# EAGLE design nav_module (EAGLE 7.4.0)
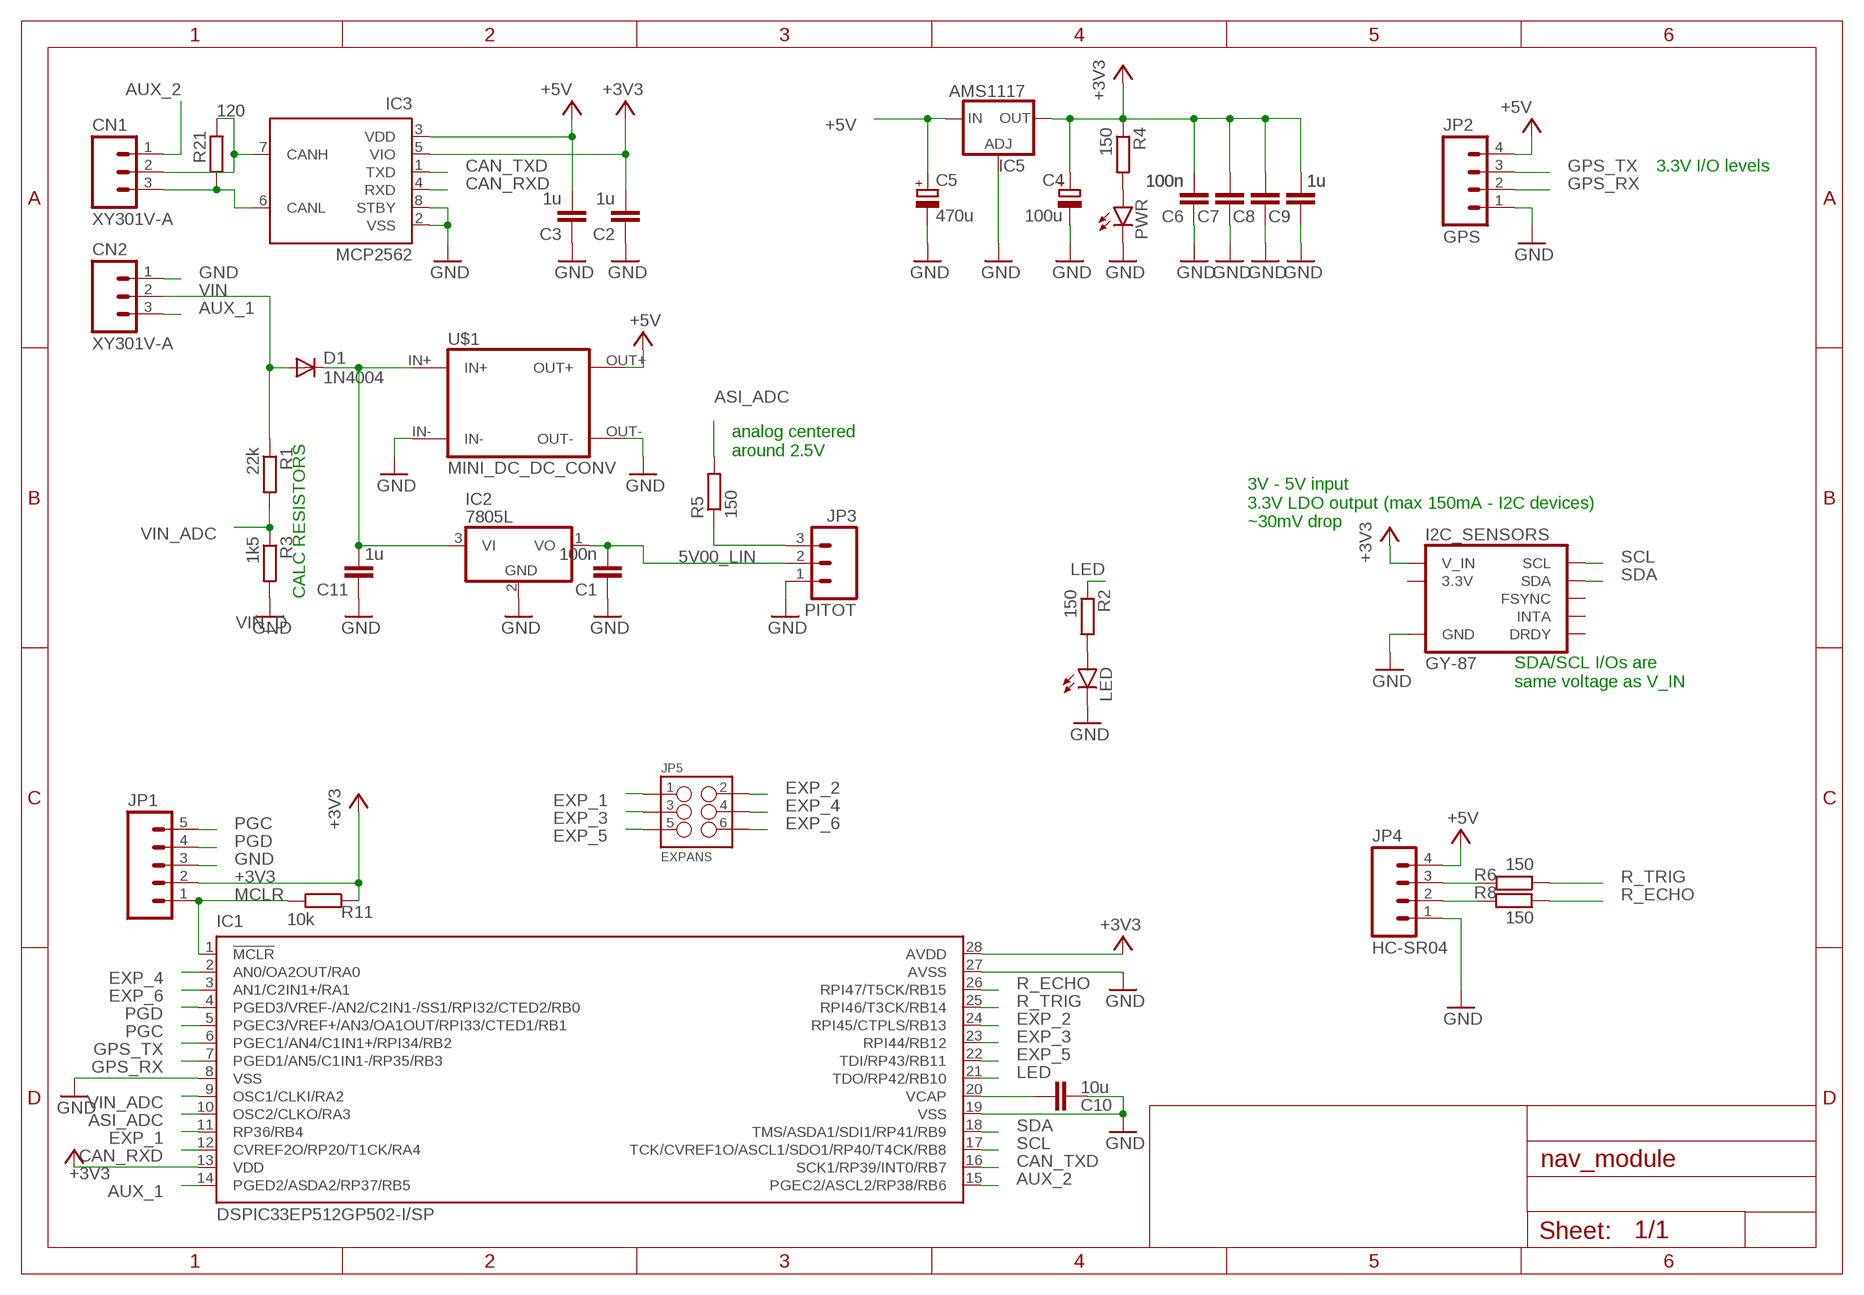
[diagram p0: schematic, sheet 1]

## Parts
C1  100n  C-EUC0603K  [C0603K]
C2  1u  C-EUC0603K  [C0603K]
C3  1u  C-EUC0603K  [C0603K]
C4  100u  CPOL-EUE2.5-7  [E2,5-7]
C5  470u  CPOL-EUE3.5-8  [E3,5-8]
C6  100n  C-EUC0603K  [C0603K]
C7  100n  C-EUC0603K  [C0603K]
C8  1u  C-EUC0603K  [C0603K]
C9  1u  C-EUC0603K  [C0603K]
C10  10u  C-EU025-030X050  [C025-030X050]
C11  1u  C-EUC0603K  [C0603K]
CN1  XY301V-A  [XY301V-A]
CN2  XY301V-A  [XY301V-A]
D1  1N4004  [DO41-10]
I2C_SENSORS  GY-87  [GY-87]
IC1  DSPIC33EP512GP502-I/SP  [DIL28-3]
IC2  7805L  [TO92]
IC3  MCP2562  MCP2562-E/P  [DIL8]
IC5  AMS1117  LD117AS33TR  [SOT223]
JP1  M05PTH  [1X05]
JP2  GPS  M04PTH  [1X04]
JP3  PITOT  M03PTH  [1X03]
JP4  HC-SR04  M04PTH  [1X04]
JP5  EXPANS  M03X2FEMALE  [2X3]
LED  LED-FKIT-1206  [FKIT-LED-1206]
PWR  LED-FKIT-1206  [FKIT-LED-1206]
R1  22k  R-EU_R0603  [R0603]
R2  150  R-EU_R0603  [R0603]
R3  1k5  R-EU_R0603  [R0603]
R4  150  R-EU_R0603  [R0603]
R5  150  R-EU_R0603  [R0603]
R6  150  R-EU_R0603  [R0603]
R8  150  R-EU_R0603  [R0603]
R11  10k  R-EU_R0603  [R0603]
R21  120  R-EU_R0603  [R0603]
U$1  MINI_DC_DC_CONV  [DSN-MINI-360]

## Nets
5V00_LIN: C1.2 IC2.1(VO) JP3.2
+3V3: C2.2 C4.+ C6.2 C7.2 C8.2 C9.2 I2C_SENSORS.VCC_IN(V_IN) IC1.13(VDD) IC1.28(AVDD) IC3.5(VIO) IC5.2(OUT) IC5.@2(OUT) JP1.2 R4.1 R11.1
+5V: C3.2 C5.+ IC3.3(VDD) IC5.3(IN) JP2.4 JP4.4 U$1.OUT+
ASI: JP3.3 R5.1
ASI_ADC: IC1.10(OSC2/CLKO/RA3) R5.2
AUX_1: CN2.3 IC1.14(PGED2/ASDA2/RP37/RB5)
AUX_2: CN1.1 IC1.15(PGEC2/ASCL2/RP38/RB6)
CAN_H: CN1.2 IC3.7(CANH) R21.2
CAN_L: CN1.3 IC3.6(CANL) R21.1
CAN_RXD: IC1.12(CVREF2O/RP20/T1CK/RA4) IC3.4(RXD)
CAN_TXD: IC1.16(SCK1/RP39/INT0/RB7) IC3.1(TXD)
EXP_1: IC1.11(RP36/RB4) JP5.1
EXP_2: IC1.24(RPI45/CTPLS/RB13) JP5.2
EXP_3: IC1.23(RPI44/RB12) JP5.3
EXP_4: IC1.2(AN0/OA2OUT/RA0) JP5.4
EXP_5: IC1.22(TDI/RP43/RB11) JP5.5
EXP_6: IC1.3(AN1/C2IN1+/RA1) JP5.6
GND: C1.1 C2.1 C3.1 C4.- C5.- C6.1 C7.1 C8.1 C9.1 C10.1 C11.1 CN2.1 I2C_SENSORS.GND IC1.8(VSS) IC1.19(VSS) IC1.27(AVSS) IC2.2(GND) IC3.2(VSS) IC3.8(STBY) IC5.1(ADJ) JP1.3 JP2.1 JP3.1 JP4.1 LED.C PWR.C R3.2 U$1.IN- U$1.OUT-
GPS_RX: IC1.7(PGED1/AN5/C1IN1-/RP35/RB3) JP2.2
GPS_TX: IC1.6(PGEC1/AN4/C1IN1+/RPI34/RB2) JP2.3
HS_ECHO: JP4.2 R8.1
HS_TRIG: JP4.3 R6.2
LED: IC1.21(TDO/RP42/RB10) R2.1
MCLR: IC1.1(!MCLR!) JP1.1 R11.2
N$3: PWR.A R4.2
N$4: LED.A R2.2
PGC: IC1.5(PGEC3/VREF+/AN3/OA1OUT/RPI33/CTED1/RB1) JP1.5
PGD: IC1.4(PGED3/VREF-/AN2/C2IN1-/SS1/RPI32/CTED2/RB0) JP1.4
R_ECHO: IC1.26(RPI47/T5CK/RB15) R8.2
R_TRIG: IC1.25(RPI46/T3CK/RB14) R6.1
SCL: I2C_SENSORS.SCL IC1.17(TCK/CVREF1O/ASCL1/SDO1/RP40/T4CK/RB8)
SDA: I2C_SENSORS.SDA IC1.18(TMS/ASDA1/SDI1/RP41/RB9)
VCAP: C10.2 IC1.20(VCAP)
VIN: CN2.2 D1.A R1.1
VIN_ADC: IC1.9(OSC1/CLKI/RA2) R1.2 R3.1
VIN_D: C11.2 D1.C IC2.3(VI) U$1.IN+
Unconnected: I2C_SENSORS.DRDY I2C_SENSORS.FSYNC I2C_SENSORS.INTA

## Notes on the sheet
- 3.3V I/O levels
- analog centered
  around 2.5V
- 3V - 5V input
  3.3V LDO output (max 150mA - I2C devices)
  ~30mV drop
- CALC RESISTORS
- SDA/SCL I/Os are
  same voltage as V_IN

## Power pins joined to a net without a drawn wire
3.3V: I2C_SENSORS.3.3V

## Library data of the parts
C1-C3 C6-C11 = rcl:C-EU: CAPACITOR, European symbol
C4 C5 = rcl:CPOL-EU: POLARIZED CAPACITOR, European symbol
CN1 CN2 = aliexpress_modules:XY301V-A: 3 Pin Screw Terminal Block Connector 5mm Pitch 5.08-301-3P 301-3P 3pin
D1 = diode:1N4004: DIODE general purpose rectifier, 1 A
I2C_SENSORS = aliexpress_modules:GY-87: GY-87 10DOF MPU6050 HMC5883L BMP180 module
IC1 = microchip:DSPIC33EP512*502: 16-Bit Microcontrollers and Digital Signal Controllers with High-Speed PWM, Op Amps and Advanced Analog Source: ww1.microchip.com/downloads/en/DeviceDoc/70000657H.pdf
IC2 = linear:78*: Positive VOLTAGE REGULATOR Source: http://cache.national.com/ds/LM/LM78L05.pdf http://www.fairchildsemi.com/ds/LM/LM7805.pdf
IC3 = microchip:MCP2562: High-Speed CAN Transceiver Source: http://ww1.microchip.com/downloads/en/DeviceDoc/20005167C.pdf
IC5 = v-reg:LD117A?*: Low drop fixed and adjustable positive voltage regulators 1 A Source: http://www.st.com/stonline/products/literature/ds/7194/ld1117axx.pdf
JP1 = SparkFun-Connectors:M05: Header 5 Standard 5-pin 0.1" header. Use with straight break away headers (SKU : PRT-00116), right angle break away headers (PRT-00553), swiss pins (PRT-00743), machine pins (PRT-00117), and female headers (PRT-00115). Molex polarized connector foot print use with SKU : PRT-08230 with associated crimp pins and housings.
JP2 JP4 = SparkFun-Connectors:M04: Header 4 Standard 4-pin 0.1" header. Use with straight break away headers (SKU : PRT-00116), right angle break away headers (PRT-00553), swiss pins (PRT-00743), machine pins (PRT-00117), and female headers (PRT-00115). Molex polarized connector foot print use with SKU : PRT-08231 with associated crimp pins and housings. 1MM SMD Version SKU: PRT-10208
JP3 = SparkFun-Connectors:M03: Header 3 Standard 3-pin 0.1" header. Use with straight break away headers (SKU : PRT-00116), right angle break away headers (PRT-00553), swiss pins (PRT-00743), machine pins (PRT-00117), and female headers (PRT-00115). Molex polarized connector foot print use with SKU : PRT-08232 with associated crimp pins and housings.
JP5 = SparkFun-Connectors:M03X2: 2x3 .1" header. Shrouded, with keying- CONN-10681 SMT- CONN-11415 Pogo pins- HW-11044; PROD_ID: CONN-11566; VALUE: FEMALE 2x3
LED PWR = SparkFun-LED:LED: LEDs Standard schematic elements and footprints for 5mm, 3mm, 1206, and 0603 sized LEDs. 5mm - Spark Fun Electronics SKU : COM-00529 (and others)
R1-R6 R8 R11 R21 = rcl:R-EU_: RESISTOR, European symbol
U$1 = aliexpress_modules:MINI_DC_DC_CONV: RC Airplane Module Mini 360 DC Buck Converter Step Down Module 4.75V-23V to 1V-17V 17x11x3.8mm New LM2596; $1.06 Input voltage: 4.75V-23V; Output voltage: 1.0V-17V; Current output: peak 3A, 1.8A long time

## Board
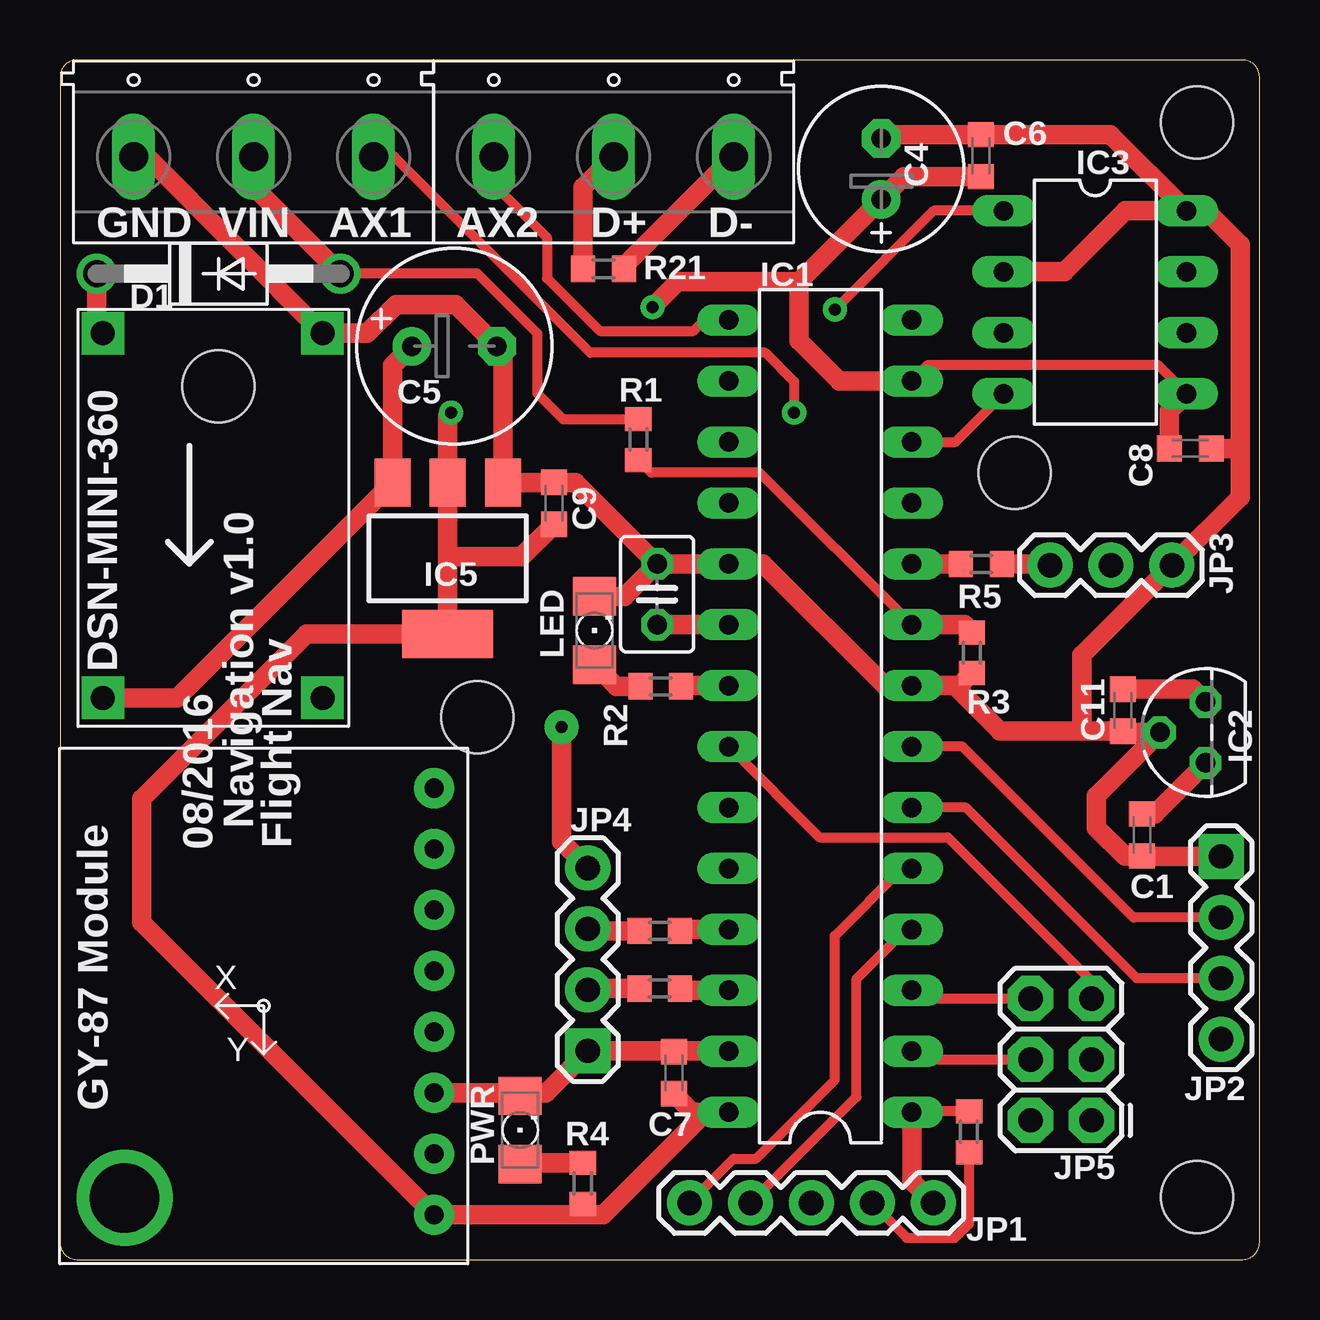
[diagram p1: board, top side]
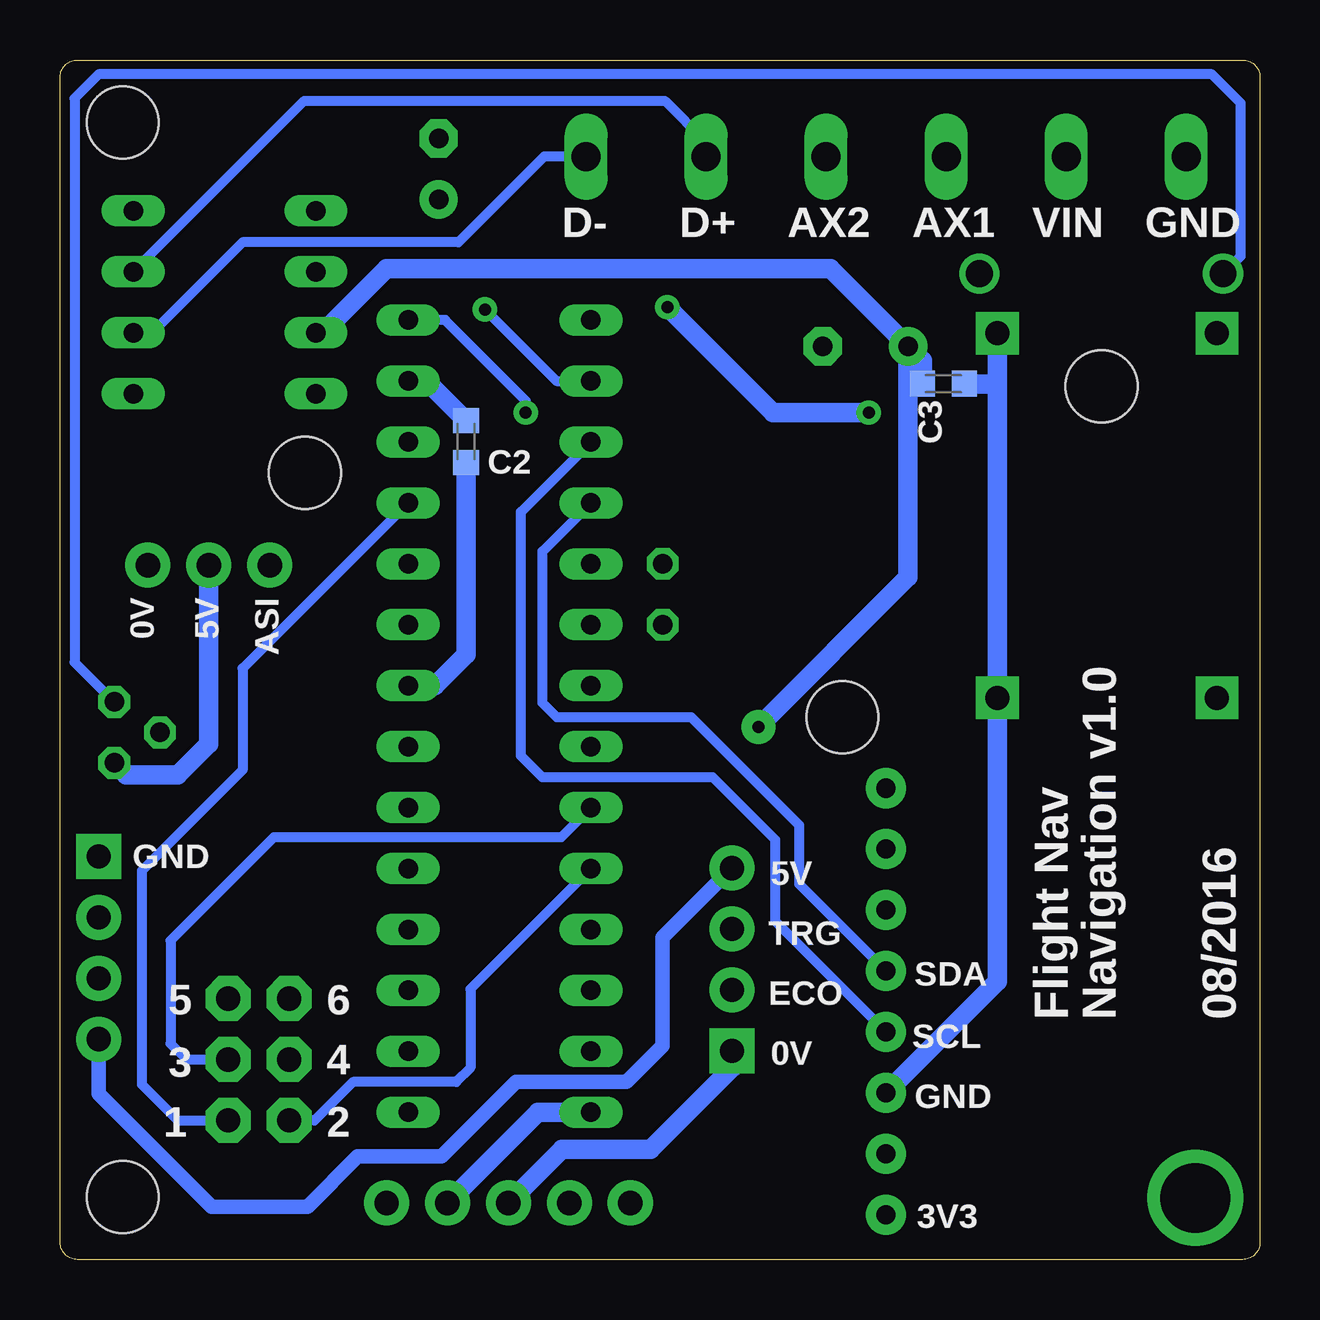
[diagram p2: board, bottom side, seen from below]

Size 50 x 50 mm. Coordinates in mm from the lower left corner, seen from the top.
Outline: 0,49.29 0,0.71 arc90 0.71,0 49.29,0 arc90 50,0.71 50,49.29 arc90 49.29,50 0.71,50 arc90 0,49.29
Copper layers (1*16): Top 0.035mm / dielectric 1.5mm / Bottom 0.035mm
Design rules "ITEAD_DRU_CHECK": minimum track width 6mil, minimum drill 12mil, track to track 6mil, track to pad 6mil, pad to pad 6mil, via to via 6mil, smd to smd 0mil, copper to edge 10mil, drill to drill 10mil, minimum pad ring 10mil, minimum via ring 6mil, stop-mask expansion 2mil, vias tented up to drill 100mil, thermal gap 10mil
Holes 3 mm at 47.4,2.6 17.4,22.6 47.4,47.4 39.8,32.8 6.6,36.4

### Footprints (pad centres in the part's own frame; a part is rotated, then mirrored left to right if it is on the bottom)
C0603K = smd 1.05 x 1.08: 1 -0.875,0; 2 0.875,0
E2,5-7 = drill 0.813 pad 1.6: + -1.27,0 | drill 0.813 pad 1.6 octagon: - 1.27,0
E3,5-8 = drill 0.813 pad 1.6: + -1.778,0 | drill 0.813 pad 1.6 octagon: - 1.778,0
C025-030X050 = drill 0.813 octagon: 1 -1.27,0; 2 1.27,0
XY301V-A = drill 1.2 long: 1 -5,0; 2 0,0; 3 5,0
DO41-10 = drill 1.118: A 5.08,0; C -5.08,0
GY-87 = drill 0.8 pad 1.676: 3.3V -7.1,6.16; DRDY -7.1,-9.08; FSYNC -7.1,-4; GND -7.1,3.62; INTA -7.1,-6.54; SCL -7.1,1.08; SDA -7.1,-1.46; VCC_IN -7.1,8.7 | drill 2.9 pad 4: N/C 5.8,8
DIL28-3 = drill 0.813 long: 1 -16.51,-3.81; 2 -13.97,-3.81; 3 -11.43,-3.81; 4 -8.89,-3.81; 5 -6.35,-3.81; 6 -3.81,-3.81; 7 -1.27,-3.81; 8 1.27,-3.81; 9 3.81,-3.81; 10 6.35,-3.81; 11 8.89,-3.81; 12 11.43,-3.81; 13 13.97,-3.81; 14 16.51,-3.81; 15 16.51,3.81; 16 13.97,3.81; 17 11.43,3.81; 18 8.89,3.81; 19 6.35,3.81; 20 3.81,3.81; 21 1.27,3.81; 22 -1.27,3.81; 23 -3.81,3.81; 24 -6.35,3.81; 25 -8.89,3.81; 26 -11.43,3.81; 27 -13.97,3.81; 28 -16.51,3.81
TO92 = drill 0.813 octagon: 1 -1.27,0; 2 0,1.905; 3 1.27,0
DIL8 = drill 0.813 long: 1 -3.81,-3.81; 2 -1.27,-3.81; 3 1.27,-3.81; 4 3.81,-3.81; 5 3.81,3.81; 6 1.27,3.81; 7 -1.27,3.81; 8 -3.81,3.81
SOT223 = smd 1.5 x 2: 1 -2.3,-3.15; 2 0,-3.15; 3 2.3,-3.15 | smd 3.8 x 2: @2 0,3.15
1X05 = drill 1.016 pad 1.88: 1 0,0; 2 2.54,0; 3 5.08,0; 4 7.62,0; 5 10.16,0
1X04 = drill 1.016 pad 1.88 square: 1 0,0 | drill 1.016 pad 1.88: 2 2.54,0; 3 5.08,0; 4 7.62,0
1X03 = drill 1.016 pad 1.88: 1 0,0; 2 2.54,0; 3 5.08,0
2X3 = drill 1.016 pad 1.88 octagon: 1 0,0; 2 0,2.54; 3 2.54,0; 4 2.54,2.54; 5 5.08,0; 6 5.08,2.54
FKIT-LED-1206 = smd 1.6 x 1.803: A -1.422,0; C 1.422,0
R0603 = smd 1 x 1.1: 1 -0.85,0; 2 0.85,0
DSN-MINI-360 = drill 1 pad 1.778 square: IN+ 7.7,4.6; IN- 7.7,-4.55; OUT+ -7.5,4.6; OUT- -7.5,-4.55

### Placement (x,y rotation side)
C1  45.1,17.7 90 top
C2  33.09,34.1 90 bottom
C3  13.19,36.51 180 bottom
C4  34.23,45.46 90 top
C5  16.44,38.07 0 top
C6  38.39,46.01 270 top
C7  25.59,7.79 270 top
C8  47.12,33.81 180 top
C9  20.59,31.52 270 top
C10  24.89,27.73 270 top
C11  44.3,22.9 90 top
CN1  23.08,45.97 0 top
CN2  8.07,45.97 0 top
D1  6.61,41.09 0 top
I2C_SENSORS  8.49,10.57 180 top
IC1  31.69,22.65 90 top
IC2  47.75,21.97 90 top
IC3  43.15,39.9 270 top
IC5  16.16,29.23 180 top
JP1  36.4,2.36 180 top
JP2  48.4,16.8 270 top
JP3  46.35,28.94 180 top
JP4  22,8.7 90 top
JP5  43,5.8 90 top
LED  22.28,26.22 90 top
PWR  19.18,5.4 90 top
R1  24.11,34.18 270 top
R2  25.04,23.89 180 top
R3  38.01,25.29 270 top
R4  21.79,3.18 90 top
R5  38.4,28.99 180 top
R6  25,13.7 180 top
R8  25,11.3 0 top
R11  37.89,5.32 90 top
R21  22.66,41.29 180 top
U$1  6.39,30.91 90 top

### Tracks (layer width: path | path; a pad name or v marks a point on that pad's centre or on a via)
5V00_LIN
  Top 0.813: C1.2 45.62,18.57 IC2.1
  Bottom 0.813: IC2.1 47.25,20.2 45.1,20.2 43.81,21.49 JP3.2
+3V3  (via drill 0.5 pad 1.02)
  Top 0.406: JP1.2 33.86,2.34 35.3,0.9 37.3,0.9 37.9,1.5 R11.1 | IC1.13 36.18,37.3 45.75,37.3 IC3.5
  Top 0.813: 16.16,29.3 IC5.2 16.16,35.16 v16.3,35.3 | 16.16,29.3 IC5.@2 10.28,26.08 3.4,19.2 3.4,14.06 I2C_SENSORS.VCC_IN 21.8,1.87 | IC1.28 26.9,6.14 | 26.9,6.14 26.36,6.14 C7.2 | 21.8,1.87 22.63,1.87 26.9,6.14 | C9.2 19.25,29.3 16.16,29.3 | IC3.5 46.24,35.38 C8.2 | 34.68,36.62 IC1.13 32.48,36.62 30.8,38.3 30.8,40.76 | C6.2 35.17,45.13 C4.+ 30.8,40.76 | R4.1 21.8,1.87 | v24.7,39.7 25.76,40.76 30.8,40.76
  Bottom 0.813: JP1.2 30.08,6.14 IC1.28 | C2.2 34.73,36.62 IC1.13 | v24.7,39.7 20.3,35.3 v16.3,35.3
+5V  (via drill 0.5 pad 1.42)
  Top 0.813: U$1.OUT+ 4.89,23.41 IC5.3 13.86,37.27 C5.+ | JP4.4 20.9,17.42 v20.9,22.2
  Bottom 0.61: JP4.4 24.9,13.42 24.9,8.9 26.4,7.4 31,7.4 34.1,4.3 37.6,4.3 39.7,2.2 43.7,2.2 48.4,6.9 JP2.4
  Bottom 0.813: C3.2 14.06,37.47 C5.+ | C5.+ 17.89,41.3 36.4,41.3 39.07,38.63 IC3.3 | C5.+ 14.66,28.44 v20.9,22.2
ASI
  Top 0.813: JP3.3 41.22,28.99 R5.1
ASI_ADC
  Top 0.813: R5.2 IC1.10
AUX_1  (via drill 0.5 pad 1.02)
  Top 0.406: CN2.3 13.93,45.97 22.1,37.8 29.4,37.8 30.6,36.6 v30.6,35.3
  Bottom 0.406: IC1.14 33.96,39.16 30.6,35.8 v30.6,35.3
AUX_2
  Top 0.406: CN1.1 18.08,44.82 20.3,42.6 20.3,40.9 22.5,38.7 26.4,38.7 26.86,39.16 IC1.15
CAN_H
  Top 0.813: R21.2 21.81,44.7 CN1.2
  Bottom 0.406: IC3.7 39.83,48.3 24.8,48.3 23.08,46.58 CN1.2
CAN_L
  Top 0.813: R21.1 23.51,41.4 CN1.3
  Bottom 0.406: CN1.3 29.83,45.97 33.4,42.4 42.4,42.4 46.17,38.63 IC3.6
CAN_RXD
  Top 0.406: IC1.12 37.33,34.08 IC3.4
CAN_TXD  (via drill 0.5 pad 1.02)
  Top 0.406: IC3.1 36.41,43.71 v32.3,39.6
  Bottom 0.406: v32.3,39.6 29.32,36.62 IC1.16
EXP_1
  Bottom 0.406: IC1.11 42.4,24.64 42.4,20.4 46.6,16.2 46.6,7.3 45.1,5.8 JP5.1
EXP_2
  Bottom 0.406: IC1.24 32.9,11.28 32.9,8 33.5,7.4 37.8,7.4 39.4,5.8 JP5.2
EXP_3
  Bottom 0.406: IC1.23 29.12,17.6 41.1,17.6 45.4,13.3 45.4,9 44.74,8.34 JP5.3
EXP_4
  Top 0.406: IC1.2 35.84,8.34 JP5.4
EXP_5
  Top 0.406: IC1.22 31.66,17.6 37,17.6 43,11.6 JP5.5
EXP_6
  Top 0.406: IC1.3 35.84,10.88 JP5.6
GND
  Top 0.813: CN2.1 3.63,45.97 U$1.IN- 12.81,38.61 14,39.8 16.49,39.8 C5.- 18.46,37.83 IC5.1 18.48,32.4 C9.1 21.5,32.4 C10.1 | C10.1 IC1.19 29.3,29 34.4,23.9 35.48,23.9 IC1.8 | I2C_SENSORS.GND 19.1,6.95 | 19.1,6.95 20.25,6.95 JP4.1 25.2,8.7 | 25.2,8.7 27.86,8.7 IC1.27 | C7.1 25.23,8.66 25.2,8.7 | 46.02,21.79 IC2.2 | IC2.2 44.35,21.97 C11.1 42.6,22.02 | 42.6,22.02 39.17,22.02 37.28,23.92 IC1.8 | 42.6,22.02 42.6,25.19 JP3.1 49.2,31.79 49.2,33.8 | 49.2,33.8 49.2,42.3 47.79,43.71 IC3.8 | IC3.8 44.41,43.71 41.87,41.17 IC3.2 | C8.1 48.01,33.8 49.2,33.8 | C4.- 34.38,46.88 C6.1 43.78,46.88 IC3.8 | C10.1 23.53,27.64 LED.C | PWR.C 19.1,6.94 19.1,6.95 | R3.2 37.49,23.92 IC1.8 | JP2.1 45.12,16.8 C1.1 44.38,16.82 43.2,18 43.2,19.32 IC2.2
  Bottom 0.813: 11,38.6 U$1.IN- 10.94,36.5 | I2C_SENSORS.GND 10.94,11.6 U$1.OUT- 10.94,36.5 | JP1.3 29.08,4.6 25.4,4.6 22,8 JP4.1 | C2.1 33.09,25.21 34.38,23.92 IC1.8 | C3.1 10.94,36.5
GPS_RX
  Top 0.406: JP2.2 44.74,14.26 37.62,21.38 IC1.7
GPS_TX
  Top 0.406: JP2.3 44.88,11.72 37.76,18.84 IC1.6
HS_ECHO
  Top 0.813: R8.1 22.06,11.3 JP4.2
HS_TRIG
  Top 0.813: R6.2 22.08,13.7 JP4.3
LED
  Top 0.813: R2.1 25.92,23.92 IC1.21
MCLR
  Top 0.406: R11.2 35.53,6.17 IC1.1
  Top 0.813: IC1.1 35.5,3.26 JP1.1
N$3
  Top 0.813: PWR.A 19.03,4.03 R4.2
N$4
  Top 0.813: LED.A 23.19,23.89 R2.2
PGC
  Top 0.406: JP1.5 28.08,4.2 29,4.2 32.3,7.5 32.3,13.5 35.1,16.3 IC1.5
PGD
  Top 0.406: JP1.4 33.2,6.78 33.2,11.7 35.26,13.76 IC1.4
R_ECHO
  Top 0.813: IC1.26 25.93,11.22 R8.2
R_TRIG
  Top 0.813: IC1.25 25.91,13.76 R6.1
SCL
  Bottom 0.406: I2C_SENSORS.SCL 20.2,14.1 20.2,17.5 22.8,20.1 29.9,20.1 30.8,21 30.8,31.16 IC1.17
SDA
  Bottom 0.406: I2C_SENSORS.SDA 19.2,15.64 19.2,18.1 23.7,22.6 29.3,22.6 29.9,23.2 29.9,29.52 IC1.18
VCAP
  Top 0.813: IC1.20 C10.2
VIN
  Top 0.406: R1.1 20.97,35.03 19.9,36.1 19.9,38.6 17.4,41.1 D1.A
  Top 0.813: CN2.2 8.07,44.71 D1.A
VIN_ADC
  Top 0.406: IC1.9 29.16,32.8 24.64,32.8 R1.2
  Top 0.813: R3.1 37.69,26.46 IC1.9
VIN_D
  Top 0.813: D1.C 1.53,38.87 U$1.IN+ | C11.2 47.22,23.77 IC2.3
  Bottom 0.406: D1.C 0.8,41.82 0.8,48.2 2,49.4 48.4,49.4 49.4,48.4 49.4,24.89 IC2.3

### Text on the board
tPlace: GND | VIN | AX1 | AX2 | D+ | D- | Navigation v1.0 | Flight Nav | DSN-MINI-360 | 08/2016 | GY-87 Module
bPlace: GND | VIN | AX1 | AX2 | D+ | D- | ASI | 5V | 0V | 5V | GND | TRG | SDA | ECO | 08/2016 | Navigation v1.0 | Flight Nav | 6 | 5 | SCL | 0V | 4 | 3 | GND | 2 | 1 | 3V3